# Altium schematic sheet O3_Potentiostat.SchDoc
size A4
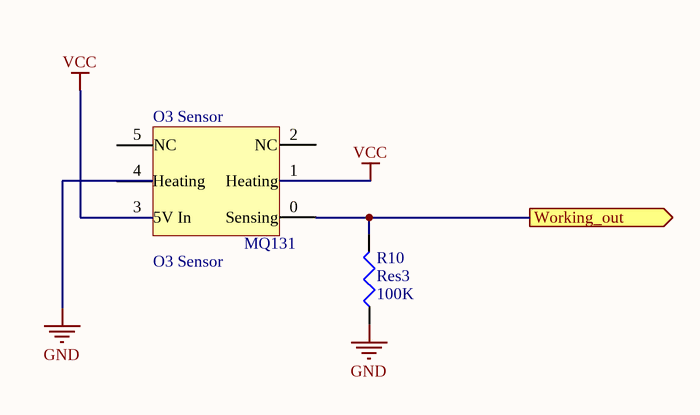
[diagram p0: O3_Potentiostat.SchDoc]

## Parts
O3_Sensor  O3 Sensor  [O3_Sensor]
R10  Res3  value 100K  [J1-0603]

## Ports
Working_out (out)

## Nets
GND: O3_Sensor.4(Heating) R10.1
VCC: O3_Sensor.1(Heating) O3_Sensor.3(5V_In)
Working_out: R10.2 ; port Working_out

Not connected (* = marked no-connect by the designer): O3_Sensor 0(Sensing) 2(NC) 5(NC)

## Library data of the parts
O3_Sensor = MQ131
R10 = Res3: Resistor; Published: 8-Jun-2000; LatestRevisionDate: 29-May-2009; LatestRevisionNote: IPC-7351 Footprint Added.; PackageReference: J1-0603; Publisher: Altium Limited; PackageDescription: Chip Resistor